# Altium schematic sheet Clock_fanout.SchDoc: RFSOC SAWG
size 420 x 297 mm; Author: G.Kasprowicz; CompanyName: WUT ISE; DrawnBy: G.Kasprowicz; Organization: WUT ISE; Address1: PW ISE; Address2: Nowowiejska 15/19 00-665 Warsaw; Address3: gkasprow@gmail.com; Revision: 1; SheetNumber: 4; SheetTotal: 4; ModifiedBy: -; CheckedDate: -; Title2: Clock fanout; DivGrp: WUT ISE; Designer: G.Kasprowicz; ModifiedDate: -; ProjectName: Sensor Box
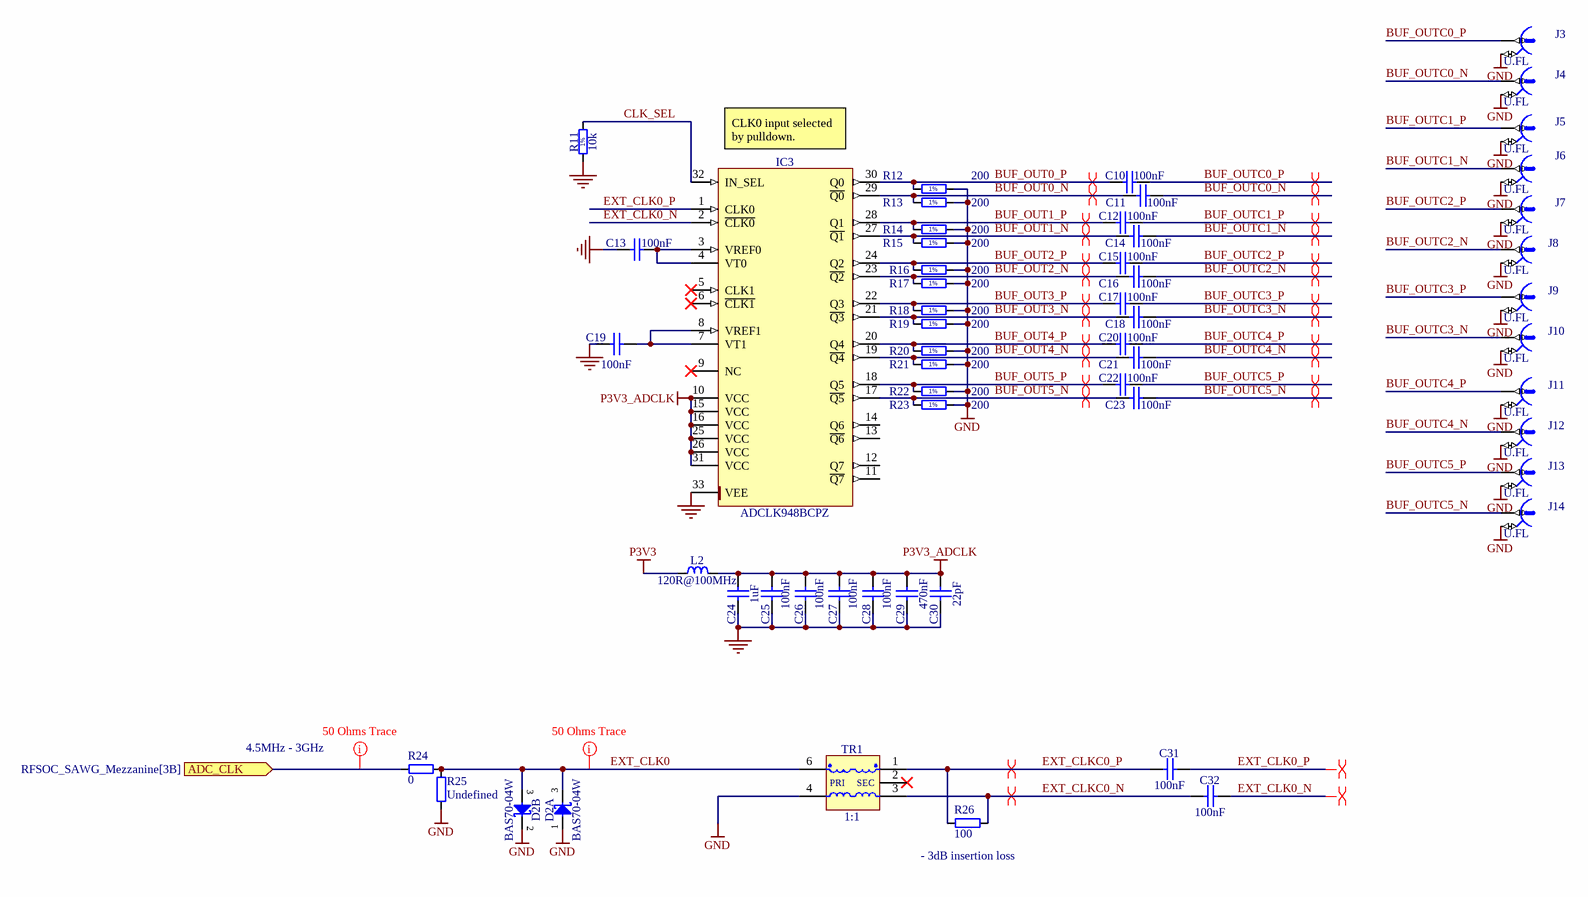
[diagram p0: Clock_fanout.SchDoc]

## Parts
C10  100nF  [CAPC0603X33N]
C11  100nF  [CAPC0603X33N]
C12  100nF  [CAPC0603X33N]
C13  100nF  [CAPC0603X33N]
C14  100nF  [CAPC0603X33N]
C15  100nF  [CAPC0603X33N]
C16  100nF  [CAPC0603X33N]
C17  100nF  [CAPC0603X33N]
C18  100nF  [CAPC0603X33N]
C19  100nF  [CAPC0603X33N]
C20  100nF  [CAPC0603X33N]
C21  100nF  [CAPC0603X33N]
C22  100nF  [CAPC0603X33N]
C23  100nF  [CAPC0603X33N]
C24  1uF  [CAPC1005X55N]
C25  100nF  [CAPC0603X33N]
C26  100nF  [CAPC0603X33N]
C27  100nF  [CAPC0603X33N]
C28  100nF  [CAPC0603X33N]
C29  470nF  [CAPC0603X33N]
C30  22pF  [CAPC1005X55N]
C31  100nF  [CAPC0603X33N]
C32  100nF  [CAPC0603X33N]
D2  BAS70-04W  [SOT65P210X110-3N]  (parts A,B of 2)
IC3  ADCLK948BCPZ  [QFN50P500X500X80-33N-S285]
J3  U.FL  [HIROSE_U.FL-R-SMT-1(10)]
J4  U.FL  [HIROSE_U.FL-R-SMT-1(10)]
J5  U.FL  [HIROSE_U.FL-R-SMT-1(10)]
J6  U.FL  [HIROSE_U.FL-R-SMT-1(10)]
J7  U.FL  [HIROSE_U.FL-R-SMT-1(10)]
J8  U.FL  [HIROSE_U.FL-R-SMT-1(10)]
J9  U.FL  [HIROSE_U.FL-R-SMT-1(10)]
J10  U.FL  [HIROSE_U.FL-R-SMT-1(10)]
J11  U.FL  [HIROSE_U.FL-R-SMT-1(10)]
J12  U.FL  [HIROSE_U.FL-R-SMT-1(10)]
J13  U.FL  [HIROSE_U.FL-R-SMT-1(10)]
J14  U.FL  [HIROSE_U.FL-R-SMT-1(10)]
L2  120R@100MHz  [INDC1608X65N]
R11  10k  [RESC1005X40N]
R12  200  [RESC1005X40N]
R13  200  [RESC1005X40N]
R14  200  [RESC1005X40N]
R15  200  [RESC1005X40N]
R16  200  [RESC1005X40N]
R17  200  [RESC1005X40N]
R18  200  [RESC1005X40N]
R19  200  [RESC1005X40N]
R20  200  [RESC1005X40N]
R21  200  [RESC1005X40N]
R22  200  [RESC1005X40N]
R23  200  [RESC1005X40N]
R24  0  [RESC1005X40N]
R25  Undefined  [RESC1005X40N]
R26  100  [RESC1005X35N]
TR1  1:1  [XFMR_MINI-CIRCUITS_AT224]

## Ports
ADC_CLK (in, see RFSOC_SAWG_Mezzanine[3B])

## Nets
GND: C13.1 C19.1 C24.1 C25.1 C26.1 C27.1 C28.1 C29.1 C30.1 D2.1(A) D2.2(C) IC3.33(VEE) J3.2 J4.2 J5.2 J6.2 J7.2 J8.2 J9.2 J10.2 J11.2 J12.2 J13.2 J14.2 R11.1 R12.2 R13.2 R14.2 R15.2 R16.2 R17.2 R18.2 R19.2 R20.2 R21.2 R22.2 R23.2 R25.2 TR1.4(P)
P3V3: L2.2
P3V3_ADCLK: C24.2 C25.2 C26.2 C27.2 C28.2 C29.2 C30.2 IC3.10(VCC) IC3.15(VCC) IC3.16(VCC) IC3.25(VCC) IC3.26(VCC) IC3.31(VCC) L2.1
ADC_CLK: R24.1 ; port ADC_CLK
BUF_OUT0_N: C11.1 IC3.29(~{Q0}) R13.1
BUF_OUT0_P: C10.1 IC3.30(Q0) R12.1
BUF_OUT1_N: C14.1 IC3.27(~{Q1}) R15.1
BUF_OUT1_P: C12.1 IC3.28(Q1) R14.1
BUF_OUT2_N: C16.1 IC3.23(~{Q2}) R17.1
BUF_OUT2_P: C15.1 IC3.24(Q2) R16.1
BUF_OUT3_N: C18.1 IC3.21(~{Q3}) R19.1
BUF_OUT3_P: C17.1 IC3.22(Q3) R18.1
BUF_OUT4_N: C21.1 IC3.19(~{Q4}) R21.1
BUF_OUT4_P: C20.1 IC3.20(Q4) R20.1
BUF_OUT5_N: C23.1 IC3.17(~{Q5}) R23.1
BUF_OUT5_P: C22.1 IC3.18(Q5) R22.1
BUF_OUTC0_N: C11.2 J4.1
BUF_OUTC0_P: C10.2 J3.1
BUF_OUTC1_N: C14.2 J6.1
BUF_OUTC1_P: C12.2 J5.1
BUF_OUTC2_N: C16.2 J8.1
BUF_OUTC2_P: C15.2 J7.1
BUF_OUTC3_N: C18.2 J10.1
BUF_OUTC3_P: C17.2 J9.1
BUF_OUTC4_N: C21.2 J12.1
BUF_OUTC4_P: C20.2 J11.1
BUF_OUTC5_N: C23.2 J14.1
BUF_OUTC5_P: C22.2 J13.1
CLK_SEL: IC3.32(IN_SEL) R11.2
EXT_CLK0: D2.3(COMAC) R24.2 R25.1 TR1.6(PDOT)
EXT_CLK0_N: C32.2 IC3.2(~{CLK0})
EXT_CLK0_P: C31.2 IC3.1(CLK0)
EXT_CLKC0_N: C32.1 R26.2 TR1.3(S)
EXT_CLKC0_P: C31.1 R26.1 TR1.1(SDOT)
NetC13_2: C13.2 IC3.3(VREF0) IC3.4(VT0)
NetC19_2: C19.2 IC3.7(VT1) IC3.8(VREF1)

Not connected (* = marked no-connect by the designer): IC3 5(CLK1)* 6(~{CLK1})* 9(NC)* 11(~{Q7}) 12(Q7) 13(~{Q6}) 14(Q6); TR1 2(NC)*

## Layout directives
differential pair; differential pair class LVPECL: BUF_OUT0_N, BUF_OUT0_P, BUF_OUT1_N, BUF_OUT1_P, BUF_OUT2_N, BUF_OUT2_P, BUF_OUT3_N, BUF_OUT3_P, BUF_OUT4_N, BUF_OUT4_P, BUF_OUT5_N, BUF_OUT5_P, BUF_OUTC0_N, BUF_OUTC0_P, BUF_OUTC1_N, BUF_OUTC1_P, BUF_OUTC2_N, BUF_OUTC2_P, BUF_OUTC3_N, BUF_OUTC3_P, BUF_OUTC4_N, BUF_OUTC4_P, BUF_OUTC5_N, BUF_OUTC5_P
net class 50 Ohms Trace: ADC_CLK, EXT_CLK0
differential pair; differential pair class Diff_100Ohm: EXT_CLK0_N, EXT_CLK0_P, EXT_CLKC0_N, EXT_CLKC0_P

## Notes on the sheet
- (near IC3) CLK0 input selected by pulldown.
- 4.5MHz - 3GHz
- (near R26) - 3dB insertion loss
- Project/Equipment
- Document
- Designer
- Drawn by
- Check.by
- Copyright WUT ISE 2020.
  This documentation describes Open Hardware and is licensed under the CERN OHL v.1.2. You may redistribute and modify this documentation under the terms of the CERN OHL v.1.2. (http://ohwr.org/CERNOHL). This documentation is distributed WITHOUT ANY EXPRESS OR IMPLIED WARRANTY, INCLUDING OF MERCHANTABILITY, SATISFACTORY QUALITY AND FITNESS FOR A PARTICULAR PURPOSE. Please see the CERN OHL v.1.2 for applicable conditions.
- Contact
- File
- Last Mod.
- Print Date
- Sheet
- Size
- A3
- of
- Rev
- (in symbol R0402_10K_1%_0.0625W_100PPM) 1%
- (in symbol R0402_200R_1%_0.0625W_100PPM) 1%
- (in symbol XFMR_MINI-CIRCUITS_TC1-1-13M+) PRI; SEC

## Library data of the parts
C10-C23 C25-C28 C31 C32 = CC0201_100NF_6.3V_10%_X5R: Non-polarised capacitor; Part Description: SMD Multilayer Chip Ceramic Capacitor; Manufacturer: GENERIC; Manufacturer1 Part Number: 02016D104KAT2A; Voltage: 6.3V; TC: X5R; Tolerance: ±10%; Part Number: CC0201_100NF_6.3V_10%_X5R; Component Kind: Standard; Component Type: Standard; Pin Count: 2; Value: 100nF; Status: Not Recommended; Manufacturer Part Number: CC0201_100NF_6.3V_10%_X5R; Case: 0201; Mounted: Yes; Socket: No; SMD: Yes; Sense: No; Manufacturer1 Example: AVX; Manufacturer1 ComponentHeight: 0.33mm; HelpURL: \\cern.ch\dfs\Applications\Altium\Datasheets\CC0201_X5R_AVX.pdf; Author: CERN DEM JLC
  C10-C23 C25-C28: CreateDate: 2007-12-03; LatestRevisionDate: 2007-12-03
  C31 C32: CreateDate: 03.12.2007; LatestRevisionDate: 03.12.2007
C24 = CC0402_1UF_16V_10%_X5R: Non-polarised capacitor; Part Description: SMD Multilayer Chip Ceramic Capacitor; Manufacturer: GENERIC; Manufacturer1 Part Number: C1005X5R1C105KT; Voltage: 16V; TC: X5R; Tolerance: ±10%; Part Number: CC0402_1UF_16V_10%_X5R; Component Kind: Standard; Component Type: Standard; Pin Count: 2; Value: 1uF; Status: Preferred; Manufacturer Part Number: CC0402_1UF_16V_10%_X5R; Case: 0402; Mounted: Yes; Socket: No; SMD: Yes; Sense: No; Manufacturer1 Example: TDK; Manufacturer1 ComponentHeight: 0.55mm; HelpURL: \\cern.ch\dfs\Applications\Altium\Datasheets\CC0402_X5R_TDK_C.pdf; Author: CERN DEM JLC; CreateDate: 2012-10-25; LatestRevisionDate: 2012-10-25
C29 = CC0201_470NF_4V_20%_X5R: Non-polarised capacitor; Part Description: SMD Multilayer Chip Ceramic Capacitor; Manufacturer: GENERIC; Manufacturer1 Part Number: AMK063BJ474MP-F; Voltage: 4V; TC: X5R; Tolerance: ±20%; Part Number: CC0201_470NF_4V_20%_X5R; Component Kind: Standard; Component Type: Standard; Pin Count: 2; Value: 470nF; Status: Not Recommended; Manufacturer Part Number: CC0201_470NF_4V_20%_X5R; Case: 0201; Mounted: Yes; Socket: No; SMD: Yes; Sense: No; Manufacturer1 Example: TAIYO YUDEN; Manufacturer1 ComponentHeight: 0.33mm; HelpURL: \\cern.ch\dfs\Applications\Altium\Datasheets\CC0201_X5R_TAIYO-YUDEN_STANDARD-CLASS2.pdf; Author: CERN DEM JLC; CreateDate: 27.05.2010; LatestRevisionDate: 27.05.2010
C30 = CC0402_22PF_50V_5%_C0G: Non-polarised capacitor; Part Description: SMD Multilayer Chip Ceramic Capacitor; Manufacturer: GENERIC; Manufacturer1 Part Number: C0402C220J5GACTU; Voltage: 50V; TC: C0G/NP0; Tolerance: ±5%; Part Number: CC0402_22PF_50V_5%_C0G; Component Kind: Standard; Component Type: Standard; Pin Count: 2; Value: 22pF; Status: Preferred; Manufacturer Part Number: CC0402_22PF_50V_5%_C0G; Case: 0402; Mounted: Yes; Socket: No; SMD: Yes; Sense: No; Manufacturer1 Example: KEMET; Manufacturer1 ComponentHeight: 0.55mm; HelpURL: \\cern.ch\dfs\Applications\Altium\Datasheets\CC0805_C0G_KEMET_(Commercial Grade).pdf; Author: CERN DEM JLC; CreateDate: 2007-12-03; LatestRevisionDate: 2007-12-03
D2 = BAS70-04W: Serial Schottky Diode; Part Description: Dual Series General-Purpose Schottky Diodes; Manufacturer: NXP SEMICONDUCTORS; Voltage: 70V; Power: 70mA; PressFit: No; Bonding: No; Part Number: BAS70-04W; Component Kind: Standard; Component Type: Standard; Device: BAS70-04W; PackageDescription: SOT323, 0.65mm Pitch; 3 Pin, 1.25mm W X 2.00mm L X 1.10mm H body, IPC Medium Density; Manufacturer Part Number: BAS70-04W; Pin Count: 3; Case: SOT323; Mounted: Yes; Socket: No; SMD: Yes; Sense: No; ComponentHeight: 1.10mm; HelpURL: \\cern.ch\dfs\Applications\Altium\Datasheets\BAS70-04W.pdf; Author: CERN DEM JLC; CreateDate: 05.12.2013; LatestRevisionDate: 05.12.2013
IC3 = ADCLK948BCPZ: Two Selectable Inputs, 8 LVPECL Outputs, SiGe Clock Fanout Buffer; Manufacturer: ANALOG DEVICES; PressFit: No; Bonding: No; Part Number: ADCLK948BCPZ; Component Kind: Standard; Component Type: Standard; Device: ADCLK948BCPZ; PackageDescription: QFN, 0.50mm Pitch, Square; 8 Pin X 8 Pin, 5mm X 5mm X 1.00mm H body (w/thermal tab 2.85 X 2.85mm),  IPC Medium Density; Part Description: Two Selectable Inputs, 8 LVPECL Outputs, SiGe Clock Fanout Buffer; Manufacturer Part Number: ADCLK948BCPZ; Pin Count: 33; Case: QFN32; Mounted: Yes; Socket: No; SMD: Yes; Sense: No; ComponentHeight: 0.8mm; Author: CERN DEM MR; HelpURL: \\cern.ch\dfs\Applications\Altium\Datasheets\ADCLK948BCPZ.pdf; CreateDate: 2016-11-30; LatestRevisionDate: 2016-11-30
J3-J14 = HIROSE_U.FL-R-SMT-1(10): Part Description: Up to 6GHz Ultra Small Surface Mount Male Coaxial Connectors U.FL Series; Manufacturer: HIROSE (HRS); PressFit: No; Part Number: HIROSE_U.FL-R-SMT-1(10); Component Kind: Standard; Component Type: Standard; Pin Count: 2; Family: U.FL; Mounted: Yes; Socket: No; SMD: Yes; Sense: No; Status: None; Manufacturer Part Number: U.FL-R-SMT-1(10); ComponentHeight: 1.25mm; HelpURL: \\cern.ch\dfs\Applications\Altium\Datasheets\HIROSE_U.FL-R-SMT-1(10).pdf; Author: CERN DEM JLC; CreateDate: 24.03.2010; LatestRevisionDate: 24.03.2010
L2 = IND0603_MURATA_BLM18SG121TN1D: Inductor; Part Description: SMD EMIFIL Suppression Chip Ferrite Bead; Manufacturer: MURATA; Power: 3A; Resistance: 0.025R; Tolerance: ±25%; Part Number: IND0603_MURATA_BLM18SG121TN1D; Component Kind: Standard; Component Type: Standard; Pin Count: 2; Value: 120R@100MHz; Status: None; Manufacturer Part Number: BLM18SG121TN1D; Case: 0603; Mounted: Yes; Socket: No; SMD: Yes; Sense: No; ComponentHeight: 0.65mm; HelpURL: \\cern.ch\dfs\Applications\Altium\Datasheets\IND0603_MURATA_BLM18S.pdf; Author: CERN DEM JLC; CreateDate: 23.07.2014; LatestRevisionDate: 23.07.2014
R11 = R0402_10K_1%_0.0625W_100PPM: Resistor - 1%; Part Description: General Purpose Thick Film Chip Resistor; Manufacturer: GENERIC; Manufacturer1 Part Number: 232270671003L; TC: ±100ppm/°C; PressFit: No; Part Number: R0402_10K_1%_0.0625W_100PPM; Component Kind: Standard; Component Type: Standard; Pin Count: 2; Value: 10k; Status: Not Recommended; Power: 0.0625W; Tolerance: ±1%; Manufacturer Part Number: R0402_10K_1%_0.0625W_100PPM; Case: 0402; Mounted: Yes; Sense: No; Socket: No; SMD: Yes; Manufacturer1 Example: YAGEO PHYCOMP; Manufacturer1 ComponentHeight: 0.4mm; HelpURL: \\cern.ch\dfs\Applications\Altium\Datasheets\R0402_Phycomp_RC0402.pdf; Author: CERN DEM JLC; CreateDate: 03.12.2007; LatestRevisionDate: 17.10.2012
R12-R23 = R0402_200R_1%_0.0625W_100PPM: Resistor - 1%; Part Description: General Purpose Thick Film Chip Resistor; Manufacturer: GENERIC; Manufacturer1 Part Number: 232270672001L; TC: ±100ppm/°C; PressFit: No; Part Number: R0402_200R_1%_0.0625W_100PPM; Component Kind: Standard; Component Type: Standard; Pin Count: 2; Value: 200; Status: Not Recommended; Power: 0.0625W; Tolerance: ±1%; Manufacturer Part Number: R0402_200R_1%_0.0625W_100PPM; Case: 0402; Mounted: Yes; Sense: No; Socket: No; SMD: Yes; Manufacturer1 Example: YAGEO PHYCOMP; Manufacturer1 ComponentHeight: 0.4mm; HelpURL: \\cern.ch\dfs\Applications\Altium\Datasheets\R0402_Phycomp_RC0402.pdf; Author: CERN DEM JLC; CreateDate: 03.12.2007; LatestRevisionDate: 17.10.2012
R24 = R0402_0R_JUMPER: Resistor; Part Description: 1A (0.05R Max DC Resistance) Zero Ohm Jumper; Manufacturer: GENERIC; Manufacturer1 Part Number: 232270591001L; PressFit: No; Case: 0402; Value: 0; Part Number: R0402_0R_JUMPER; Component Kind: Standard; Component Type: Standard; Pin Count: 2; Status: Not Recommended; Manufacturer Part Number: R0402_0R_JUMPER; Mounted: Yes; Sense: No; Socket: No; SMD: Yes; Manufacturer1 Example: YAGEO PHYCOMP; Manufacturer1 ComponentHeight: 0.4mm; HelpURL: \\cern.ch\dfs\Applications\Altium\Datasheets\R0402_Phycomp_RC0402.pdf; Author: CERN DEM JLC; CreateDate: 03.12.2007; LatestRevisionDate: 17.10.2012
R25 = R0402_NO-VALUE: Resistor; Part Description: Reserved Footprint For a 0402 (1005) Chip Resistor; PressFit: No; Mounted: No; Case: 0402; Value: Undefined; Part Number: R0402_NO-VALUE; Component Kind: Standard; Component Type: Standard; Pin Count: 2; Status: None; Manufacturer: Undefined; Manufacturer Part Number: R0402_NO-VALUE; Sense: No; Socket: No; SMD: Yes; Manufacturer1 Example: Undefined; Manufacturer1 Part Number: Undefined; Manufacturer1 ComponentHeight: Undefined; HelpURL: Undefined; Author: CERN DEM JLC; CreateDate: 03.12.2007; LatestRevisionDate: 13.03.2008
R26 = R0402_100R_0.1%_0.063W_25PPM: Resistor - 0.1%; Part Description: Thin Film Precision Resistor; Manufacturer: GENERIC; Manufacturer1 Part Number: CPF0402B100RE1; Power: 0.063W; TC: ±25ppm/°C; PressFit: No; Case: 0402; Value: 100; Tolerance: ±0.1%; Part Number: R0402_100R_0.1%_0.063W_25PPM; Component Kind: Standard; Component Type: Standard; Pin Count: 2; Status: Not Recommended; Manufacturer Part Number: R0402_100R_0.1%_0.063W_25PPM; Mounted: Yes; Sense: No; Socket: No; SMD: Yes; Manufacturer1 Example: TE CONNECTIVITY; Manufacturer1 ComponentHeight: 0.35mm; HelpURL: \\cern.ch\dfs\Applications\Altium\Datasheets\R0402_TYCO_CPF.pdf; Author: CERN DEM JMW; CreateDate: 22.09.2015; LatestRevisionDate: 22.09.2015
TR1 = XFMR_MINI-CIRCUITS_TC1-1-13M+: 50 Ohms 4.5 To 3000MHz RF Transformers; Part Number: XFMR_MINI-CIRCUITS_TC1-1-13M+; Component Kind: Standard; Component Type: Standard; Pin Count: 5; Value: 1:1; Status: None; Part Description: 50 Ohms 4.5 to 3000MHz RF Transformer; Manufacturer: MINI-CIRCUITS; Manufacturer Part Number: TC1-1-13M+; Mounted: Yes; Socket: No; Sense: No; SMD: Yes; ComponentHeight: 3.81mm; HelpURL: \\cern.ch\dfs\Applications\Altium\Datasheets\XFMR_MINI-CIRCUITS_TC1-1-13M+.pdf; Author: CERN DEM JLC; CreateDate: 30.11.2011; LatestRevisionDate: 30.11.2011